# Altium schematic sheet eps-pay.SchDoc: EPS-PAY Interface
size A4; DocumentNumber: 2; SheetNumber: 2; SheetTotal: 8
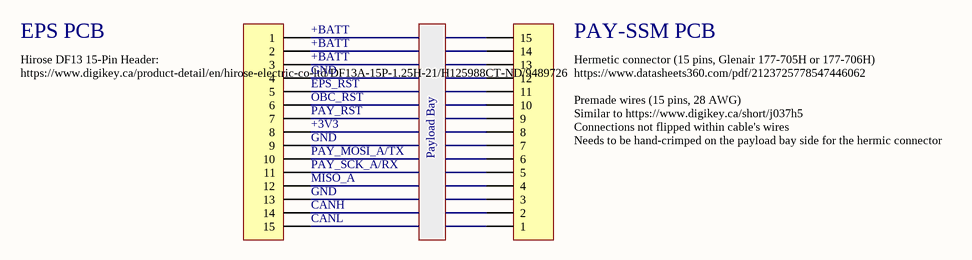
[diagram p0: eps-pay.SchDoc]

## Parts
(Parts that share a designator on the sheet are numbered #1, #2 ... from top to bottom, then left to right.)
P?#1  Header 15  [HDR1X15]  (value not drawn)
P?#2  Header 15  [HDR1X15]  (value not drawn)

## Nets

Not connected (* = marked no-connect by the designer): P?#1 1 2 3 4 5 6 7 8 9 10 11 12 13 14 15; P?#2 1 2 3 4 5 6 7 8 9 10 11 12 13 14 15

## Notes on the sheet
- EPS PCB
- (near P?#1) +BATT
- (near P?#1) GND
- PAY-SSM PCB
- Hermetic connector (15 pins, Glenair 177-705H or 177-706H)
  https://www.datasheets360.com/pdf/2123725778547446062
- Hirose DF13 15-Pin Header:
  https://www.digikey.ca/product-detail/en/hirose-electric-co-ltd/DF13A-15P-1.25H-21/H125988CT-ND/9489726
- (near P?#1) +3V3
- (near P?#1) OBC_RST
- (near P?#1) EPS_RST
- (near P?#1) PAY_RST
- Premade wires (15 pins, 28 AWG)
  Similar to https://www.digikey.ca/short/j037h5
  Connections not flipped within cable's wires
  Needs to be hand-crimped on the payload bay side for the hermic connector
- (near P?#1) CANH
- (near P?#1) PAY_MOSI_A/TX
- (near P?#1) MISO_A
- (near P?#1) PAY_SCK_A/RX
- Payload Bay
- (near P?#1) CANL

## Library data of the parts
P?#1 P?#2 = Header 15: Header, 15-Pin; LatestRevisionDate: 17-Jul-2002; LatestRevisionNote: Re-released for DXP Platform.; Publisher: Altium Limited